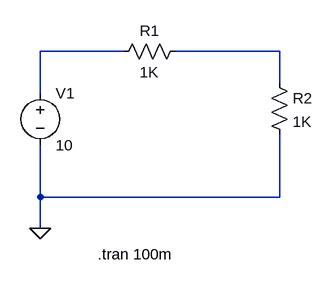
[diagram p0: schematic voltage_divider.asc]
voltage_divider.asc, the LTspice schematic file:
Version 4.1
SHEET 1 880 680
WIRE 160 160 32 160
WIRE 400 160 240 160
WIRE 400 208 400 160
WIRE 32 224 32 160
WIRE 32 384 32 304
WIRE 400 384 400 288
WIRE 400 384 32 384
WIRE 32 432 32 384
FLAG 32 432 0
SYMBOL res 256 144 R90
WINDOW 0 0 56 VBottom 2
WINDOW 3 32 56 VTop 2
SYMATTR InstName R1
SYMATTR Value 1K
SYMBOL res 384 192 R0
SYMATTR InstName R2
SYMATTR Value 1K
SYMBOL voltage 32 208 R0
SYMATTR InstName V1
SYMATTR Value 10
TEXT 120 472 Left 2 !.tran 100m

The netlist it stands for:
* voltage_divider.asc
R1 N002 N001 1K
R2 N002 0 1K
V1 N001 0 10
.tran 100m
.backanno
.end